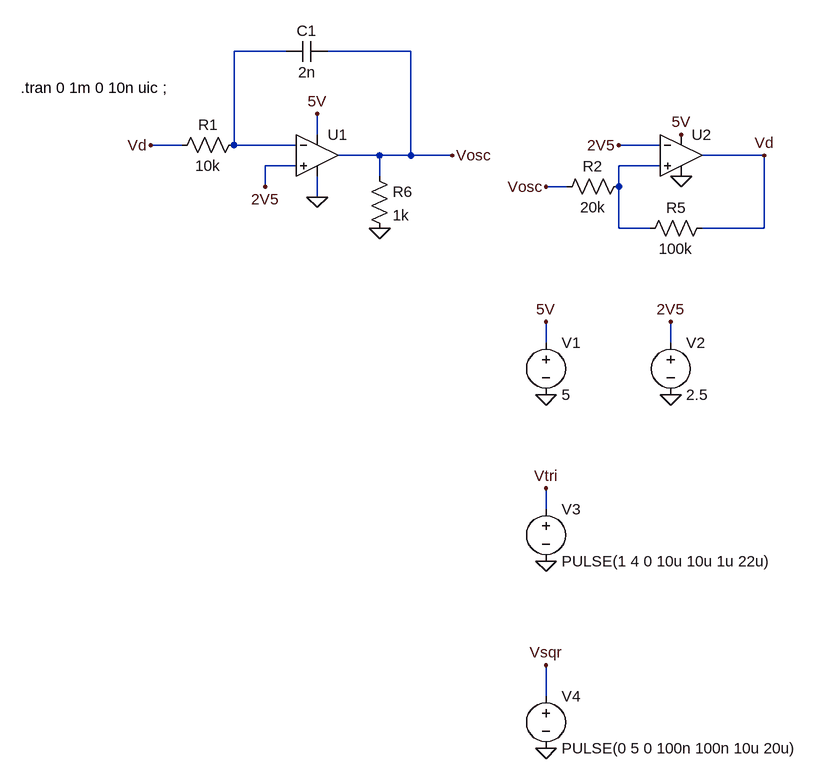
[diagram p0: schematic Draft3.asc]
Draft3.asc, the LTspice schematic file:
Version 4
SHEET 1 880 884
WIRE -736 -208 -816 -208
WIRE -544 -208 -672 -208
WIRE -688 -80 -688 -112
WIRE -896 -64 -944 -64
WIRE -816 -64 -816 -208
WIRE -720 -64 -816 -64
WIRE -160 -64 -224 -64
WIRE -592 -48 -656 -48
WIRE -544 -48 -544 -208
WIRE -544 -48 -592 -48
WIRE -480 -48 -544 -48
WIRE 0 -48 -96 -48
WIRE -720 -32 -768 -32
WIRE -160 -32 -224 -32
WIRE -592 -16 -592 -48
WIRE -768 0 -768 -32
WIRE -304 0 -336 0
WIRE -224 0 -224 -32
WIRE -688 16 -688 -16
WIRE -224 64 -224 0
WIRE -176 64 -224 64
WIRE 0 64 0 -48
WIRE 0 64 -96 64
WIRE -336 240 -336 208
WIRE -144 240 -144 208
WIRE -336 496 -336 464
WIRE -336 784 -336 736
FLAG -336 0 Vosc
FLAG -224 -64 2V5
FLAG -128 -16 0
FLAG -128 -80 5V
FLAG 0 -48 Vd
FLAG -336 576 0
FLAG -336 464 Vtri
FLAG -336 320 0
FLAG -336 208 5V
FLAG -144 320 0
FLAG -144 208 2V5
FLAG -768 0 2V5
FLAG -688 16 0
FLAG -688 -112 5V
FLAG -592 64 0
FLAG -480 -48 Vosc
FLAG -944 -64 Vd
FLAG -336 736 Vsqr
FLAG -336 864 0
SYMBOL res -208 -16 R90
WINDOW 0 0 56 VBottom 2
WINDOW 3 32 56 VTop 2
SYMATTR InstName R2
SYMATTR Value 20k
SYMBOL OpAmps\\UniversalOpAmp2 -128 -48 R0
SYMATTR InstName U2
SYMBOL res -80 48 R90
WINDOW 0 0 56 VBottom 2
WINDOW 3 32 56 VTop 2
SYMATTR InstName R5
SYMATTR Value 100k
SYMBOL voltage -336 480 R0
WINDOW 123 0 0 Left 0
WINDOW 39 0 0 Left 0
SYMATTR InstName V3
SYMATTR Value PULSE(1 4 0 10u 10u 1u 22u)
SYMBOL voltage -336 224 R0
SYMATTR InstName V1
SYMATTR Value 5
SYMBOL voltage -144 224 R0
SYMATTR InstName V2
SYMATTR Value 2.5
SYMBOL OpAmps\\UniversalOpAmp2 -688 -48 R0
SYMATTR InstName U1
SYMBOL res -800 -80 R90
WINDOW 0 0 56 VBottom 2
WINDOW 3 32 56 VTop 2
SYMATTR InstName R1
SYMATTR Value 10k
SYMBOL cap -672 -224 R90
WINDOW 0 0 32 VBottom 2
WINDOW 3 32 32 VTop 2
SYMATTR InstName C1
SYMATTR Value 2n
SYMBOL res -608 -32 R0
SYMATTR InstName R6
SYMATTR Value 1k
SYMBOL voltage -336 768 R0
WINDOW 123 0 0 Left 0
WINDOW 39 0 0 Left 0
SYMATTR InstName V4
SYMATTR Value PULSE(0 5 0 100n 100n 10u 20u)
TEXT -1144 -152 Left 2 !.tran 0 1m 0 10n uic ;

The netlist it stands for:
* Draft3.asc
R2 N002 Vosc 20k
XU2 N002 2V5 5V 0 Vd level2 Avol=1Meg GBW=10Meg Slew=10Meg Ilimit=25m Rail=0 Vos=0 En=0 Enk=0 In=0 Ink=0 Rin=500Meg  ; pins In+ In- V+ V- OUT
R5 Vd N002 100k
V3 Vtri 0 PULSE(1 4 0 10u 10u 1u 22u)
V1 5V 0 5
V2 2V5 0 2.5
XU1 2V5 N001 5V 0 Vosc level2 Avol=1Meg GBW=10Meg Slew=10Meg Ilimit=25m Rail=0 Vos=0 En=0 Enk=0 In=0 Ink=0 Rin=500Meg  ; pins In+ In- V+ V- OUT
R1 N001 Vd 10k
C1 Vosc N001 2n
R6 Vosc 0 1k
V4 Vsqr 0 PULSE(0 5 0 100n 100n 10u 20u)
.tran 0 1m 0 10n uic ;
.lib UniversalOpAmp2.lib
.backanno
.end